# Altium schematic sheet ESP32-S3-WROOM.SchDoc
size A; SheetNumber: 2; SheetTotal: 7
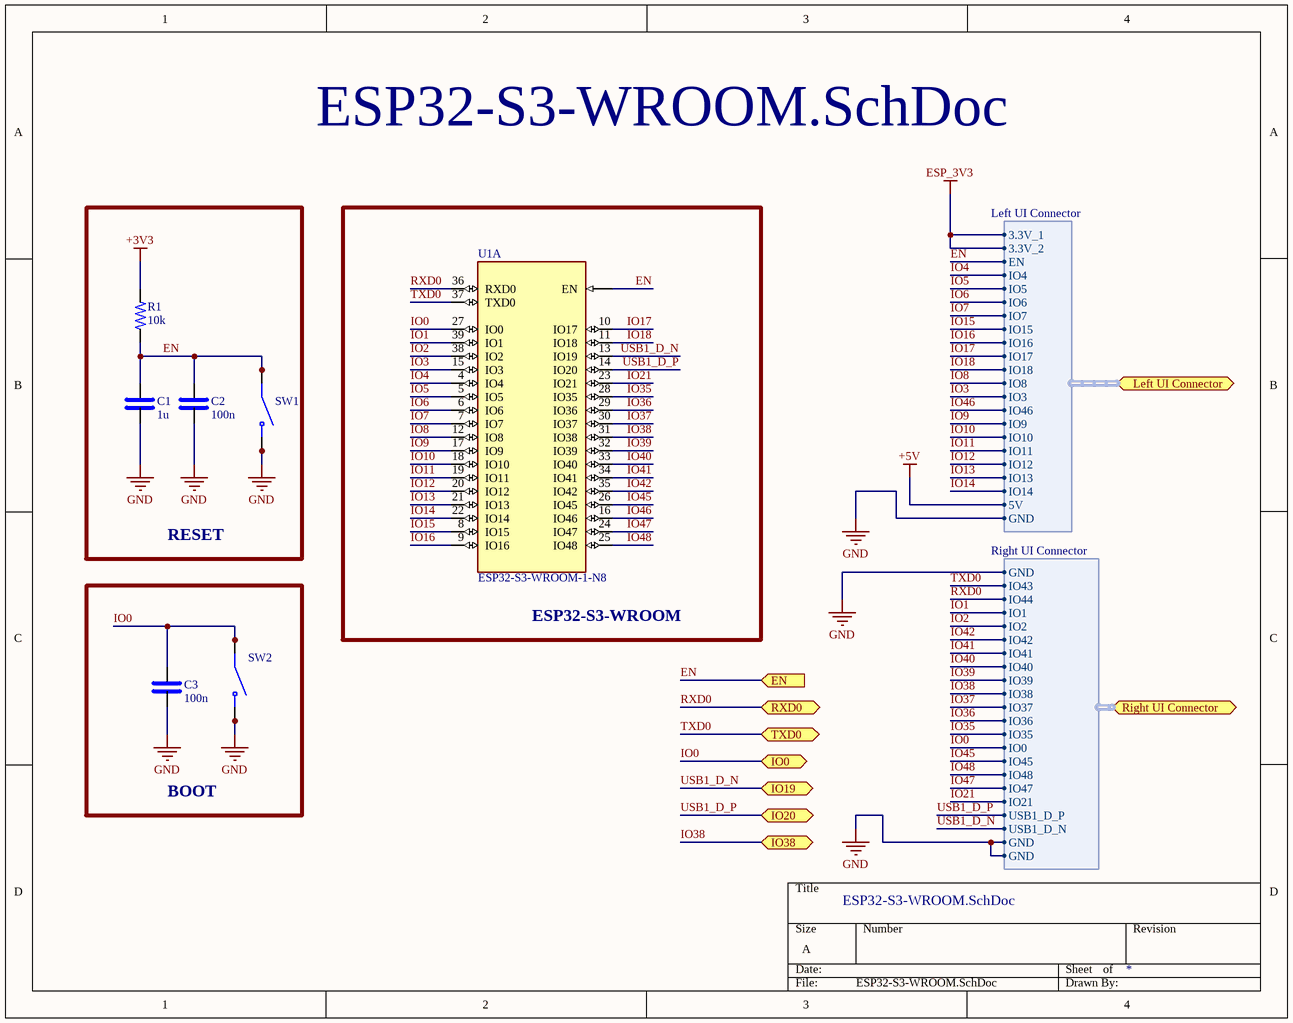
[diagram p0: ESP32-S3-WROOM.SchDoc]

## Parts
C1  1u  [FP-GCJ188-0_2-IPC_C]
C2  100n  [0402 CAP]
C3  100n  [0402 CAP]
R1  10k  [0402 RES]
SW1  KMR731NGLFS  [SW_KMR731NGLFS]  (value not drawn)
SW2  KMR731NGLFS  [SW_KMR731NGLFS]  (value not drawn)
U1  ESP32-S3-WROOM-1-N8  [XCVR_ESP32-S3-WROOM-1-N8]  (part A of 2)

## Blocks framed on the sheet
RESET: C1 C2 R1 SW1
ESP32-S3-WROOM: U1
BOOT: C3 SW2

## Ports
EN (in, see Master[2C], AutoProgram[4B]), IO0 (bidir, see Master[2C], AutoProgram[4B]), IO19 (bidir, see Master[2C]), IO20 (bidir, see Master[2C]), IO38 (bidir, see Master[2C]), Left UI Connector (bidir, harness Left UI Connector, see Master[2B], Connectors[2B]), Right UI Connector (bidir, harness Right UI Connector, see Master[2B], Connectors[4B]), RXD0 (bidir, see Master[2C]), TXD0 (bidir, see Master[2C])

## Harnesses
Right UI Connector: GND, IO43, IO44, IO1, IO2, IO35, IO36, IO37, IO38, IO39, IO40, IO41, IO42, IO0, IO45, IO48, IO47, USB1_D_N, USB1_D_P, IO21, GND, GND
Left UI Connector: 3.3V_1, 3.3V_2, EN, IO4, IO5, IO6, IO7, IO15, IO16, IO17, IO18, IO8, IO3, IO46, IO9, IO10, IO11, IO12, IO13, IO14, 5V, GND

## Nets
+3V3: R1.2
+5V: port Left UI Connector.5V
ESP_3V3: port Left UI Connector.3.3V_1, port Left UI Connector.3.3V_2
GND: C1.1 C2.1 C3.1 SW1.1(NO) SW1.2(NO) SW2.1(NO) SW2.2(NO) ; port Right UI Connector.GND, port Left UI Connector.GND
EN: C1.2 C2.2 R1.1 SW1.3(COM) SW1.4(COM) U1.3(EN) ; port EN, port Left UI Connector.EN
IO0: C3.2 SW2.3(COM) SW2.4(COM) U1.27(IO0) ; port IO0, port Right UI Connector.IO0
IO1: U1.39(IO1) ; port Right UI Connector.IO1
IO2: U1.38(IO2) ; port Right UI Connector.IO2
IO3: U1.15(IO3) ; port Left UI Connector.IO3
IO4: U1.4(IO4) ; port Left UI Connector.IO4
IO5: U1.5(IO5) ; port Left UI Connector.IO5
IO6: U1.6(IO6) ; port Left UI Connector.IO6
IO7: U1.7(IO7) ; port Left UI Connector.IO7
IO8: U1.12(IO8) ; port Left UI Connector.IO8
IO9: U1.17(IO9) ; port Left UI Connector.IO9
IO10: U1.18(IO10) ; port Left UI Connector.IO10
IO11: U1.19(IO11) ; port Left UI Connector.IO11
IO12: U1.20(IO12) ; port Left UI Connector.IO12
IO13: U1.21(IO13) ; port Left UI Connector.IO13
IO14: U1.22(IO14) ; port Left UI Connector.IO14
IO15: U1.8(IO15) ; port Left UI Connector.IO15
IO16: U1.9(IO16) ; port Left UI Connector.IO16
IO17: U1.10(IO17) ; port Left UI Connector.IO17
IO18: U1.11(IO18) ; port Left UI Connector.IO18
IO21: U1.23(IO21) ; port Right UI Connector.IO21
IO35: U1.28(IO35) ; port Right UI Connector.IO35
IO36: U1.29(IO36) ; port Right UI Connector.IO36
IO37: U1.30(IO37) ; port Right UI Connector.IO37
IO38: U1.31(IO38) ; port IO38, port Right UI Connector.IO38
IO39: U1.32(IO39) ; port Right UI Connector.IO39
IO40: U1.33(IO40) ; port Right UI Connector.IO40
IO41: U1.34(IO41) ; port Right UI Connector.IO41
IO42: U1.35(IO42) ; port Right UI Connector.IO42
IO45: U1.26(IO45) ; port Right UI Connector.IO45
IO46: U1.16(IO46) ; port Left UI Connector.IO46
IO47: U1.24(IO47) ; port Right UI Connector.IO47
IO48: U1.25(IO48) ; port Right UI Connector.IO48
RXD0: U1.36(RXD0) ; port RXD0, port Right UI Connector.IO44
TXD0: U1.37(TXD0) ; port TXD0, port Right UI Connector.IO43
USB1_D_N: U1.13(IO19) ; port IO19, port Right UI Connector.USB1_D_N
USB1_D_P: U1.14(IO20) ; port IO20, port Right UI Connector.USB1_D_P

## Library data of the parts
C1 = 0603 SMD CAP: Ceramic Capacitor, Multilayer, Ceramic, 16V, 10% +Tol, 10% -Tol, X5R, 15% TC, 1uF, Surface Mount, 0402; Manufacturer: Murata; Manufacturer Part Number: GRM188R61E106KA73D; Material: 4241ConductorMaterial; Dielectric: 1537DielectricType; Voltage Rating (DC): 25V; Multilayer: Yes; Supplier: Mouser; Supplier Part Number: 81-GRM188R61E106KA3D; RoHS: Yes; Category: Ceramic Capacitors; Stock: 343973; Pricing: 1=0.22, 10=0.073, 50=0.073, 100=0.054, 1000=0.05, 10000=0.038 (USD); Length: 1.6mm; Width: 800um; Height: 1mm; Thickness: 800um; ComponentLink1URL: https://datasheet.octopart.com/GRM188R61E106KA73D-Murata-datasheet-149523249.pdf?src-supplier=Newark; ComponentLink1Description: https://datasheet.octopart.com/GRM188R61E106KA73D-Murata-datasheet-149523249.pdf?src-supplier=Newark; ComponentLink2URL: https://search.murata.co.jp/Ceramy/image/img/A01X/G101/ENG/GRM188R61E106KA73-01.pdf?src-supplier=Digikey; ComponentLink2Description: https://search.murata.co.jp/Ceramy/image/img/A01X/G101/ENG/GRM188R61E106KA73-01.pdf?src-supplier=Digikey; ComponentLink3URL: https://datasheet.octopart.com/GRM188R61E106KA73D-Murata-datasheet-165579666.pdf?src-supplier=TME; ComponentLink3Description: https://datasheet.octopart.com/GRM188R61E106KA73D-Murata-datasheet-165579666.pdf?src-supplier=TME; Mounting Technology: Surface Mount; Pins: 2; Dielectric Material: Ceramic; Package Shape: Rectangular; Case/Package: 0402; Terminal Finish: Nickel; Min Operating Temperature: -55°C; Max Operating Temperature: 85°C; JESD-609 Code: e3; Value: 1uF; Capacitor Type: Ceramic; Tolerance  (fill in as +-): 10%; Package Style: SMTMeter; Packaging: Tape and Reel; Tolerance (fill in as +-): 10%; Rated DC Voltage (URdc): 16V; Temperature Characteristics Code: X5R; Termination: Wraparound; Reach SVHC Compliant: Yes; RoHS Compliant: Yes; ComponentLink4URL: https://datasheet.ciiva.com:443/pdfs/VipMasterIC/IC/TAIY/TAIY-S-A0009096450/TAIY-S-A0009096597-1.pdf?src-supplier=IHS+Markit; ComponentLink4Description: https://datasheet.ciiva.com:443/pdfs/VipMasterIC/IC/TAIY/TAIY-S-A0009096450/TAIY-S-A0009096597-1.pdf?src-supplier=IHS+Markit; ComponentLink5URL: https://datasheet.ciiva.com/134/emk105bj105kv-f-ss-134209.pdf?src-supplier=Digikey; ComponentLink5Description: https://datasheet.ciiva.com/134/emk105bj105kv-f-ss-134209.pdf?src-supplier=Digikey; ComponentLink6URL: https://datasheet.ciiva.com/15920/964emk105bj105kv-f-15920402.pdf?src-supplier=Onlinecomponents.com; ComponentLink6Description: https://datasheet.ciiva.com/15920/964emk105bj105kv-f-15920402.pdf?src-supplier=Onlinecomponents.com; ComponentLink7URL: https://datasheet.ciiva.com/26871/getdatasheetpartid-638287-26871289.pdf?src-supplier=Verical; ComponentLink7Description: https://datasheet.ciiva.com/26871/getdatasheetpartid-638287-26871289.pdf?src-supplier=Verical; ComponentLink8URL: https://datasheet.ciiva.com/30259/265emk105bj105kv-f-30259872.pdf?src-supplier=Onlinecomponents.com; ComponentLink8Description: https://datasheet.ciiva.com/30259/265emk105bj105kv-f-30259872.pdf?src-supplier=Onlinecomponents.com; ComponentLink9URL: https://datasheet.ciiva.com/7657/1497285-7657320.pdf?src-supplier=Element14; ComponentLink9Description: https://datasheet.ciiva.com/7657/1497285-7657320.pdf?src-supplier=Element14; ComponentLink10URL: https://datasheet.ciiva.com/22694/1497285-22694239.pdf?src-supplier=Element14; ComponentLink10Description: https://datasheet.ciiva.com/22694/1497285-22694239.pdf?src-supplier=Element14; ComponentLink11URL: https://datasheet.ciiva.com/5424/mlcc01-e-5424190.pdf?src-supplier=Mouser; ComponentLink11Description: https://datasheet.ciiva.com/5424/mlcc01-e-5424190.pdf?src-supplier=Mouser
C2 C3 = 0402 SMD Capacitor: Multilayer Ceramic Capacitor, 0.1 uF, 25 V, ï¿½ 10%, X7R, 0402 [1005 Metric]; Manufacturer: Samsung; Manufacturer Part Number: CL05B104KA5NNNC; Material: 4241ConductorMaterial; Value: 100nF; Voltage Rating: 25V; ComponentLink1Description: Link; ComponentLink1URL: *; Supplier: Digikey; Supplier Part Number: 1276-6720-1-ND; RoHS: Yes; Category: Ceramic Capacitors; Stock: 9938397; Pricing: 1=0.08, 10=0.006, 50=0.0056, 100=0.0048, 500=0.0044, 1000=0.004, 2500=0.0032 (USD); Mounting Technology: Surface Mount; Case/Package: 0402; Case Code (Metric): 1005; Case Code (Imperial): 0402; Min Operating Temperature: -55°C; Max Operating Temperature: 125°C; Packaging: Cut Tape; Tolerance: 10%; Series: CL; Voltage Rating (DC): 25V; Length: 0.039inch; Width: 0.02inch; Height: 550um; Thickness: 0.022inch; RoHS Compliant: Yes; ComponentLink2URL: https://datasheet.octopart.com/CL05B104KA5NNNC-Samsung-Electro-Mechanics-datasheet-116890910.pdf?src-supplier=Future+Electronics; ComponentLink2Description: https://datasheet.octopart.com/CL05B104KA5NNNC-Samsung-Electro-Mechanics-datasheet-116890910.pdf?src-supplier=Future+Electronics; ComponentLink3URL: http://www.samsungsem.com/kr/support/product-search/mlcc/CL05B104KA5NNNC.jsp?src-supplier=Digikey; ComponentLink3Description: http://www.samsungsem.com/kr/support/product-search/mlcc/CL05B104KA5NNNC.jsp?src-supplier=Digikey
R1 = 0402 SMD Resistor: Res Thick Film 0402 10K Ohm 5% 0.125W(1/8W) ±200ppm/C Pad SMD T/R; Manufacturer: Yageo; Manufacturer Part Number: RC0402JR-7W10KL; Value: 10kR; ComponentLink1Description: Link; ComponentLink1URL: *; Supplier: Future Electronics; Supplier Part Number: 5143940; RoHS: Yes; Category: Chip SMD Resistors; Stock: 480000; Pricing: 10000=0.0009, 50000=0.0009, 200000=0.0009, 500000=0.0009, 1250000=0.0009 (USD); Case/Package: 343Case; Packaging: 10Packaging; RoHS Compliant: Yes; ComponentLink2URL: https://datasheet.octopart.com/RC0402JR-7W10KL-Yageo-datasheet-164759695.pdf?src-supplier=Future+Electronics; ComponentLink2Description: https://datasheet.octopart.com/RC0402JR-7W10KL-Yageo-datasheet-164759695.pdf?src-supplier=Future+Electronics
SW1 SW2 = KMR731NGLFS: Tactile Switch SPST-NO Top Actuated Surface Mount; MF: C&K; Value: *; MP: KMR731NGLFS; Purchase-URL: https://pricing.snapeda.com/search/part/KMR731NGLFS/?ref=eda; Package: None; SnapEDA_Link: https://www.snapeda.com/parts/KMR731NGLFS/C&K/view-part/700258/?ref=snap; Price: None; Availability: Good
U1 = ESP32-S3-WROOM-1-N8: <a href="https://pricing.snapeda.com/parts/ESP32S3WROOM1N8R8/Espressif%20Systems/view-part?ref=eda">Check availability</a>  <a href="https://pricing.snapeda.com/parts/ESP32-S3-WROOM-1-N8R8/Espressif%20Systems/view-part?ref=eda">Check availability</a>; pin to pad: 1>1+40+41_1+41_2+41_3+41_4+41_5+41_6+41_7+41_8+41_9+41_10+41_11+41_12+41_13+41_14+41_15+41_16+41_17+41_18+41_19+41_20+41_21; MF: {'manufacturer': u'Espressif Systems'}; Package: None; Price: None; Value: *; MP: ESP32-S3-WROOM-1-N8; Availability: Unavailable